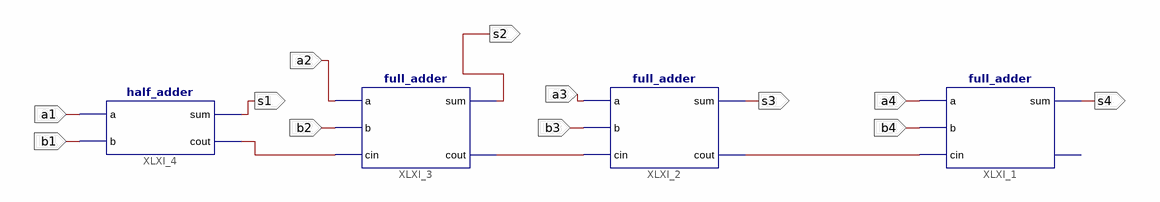
[diagram p0: schematic sheet 1]
// Xilinx ISE schematic ripple_carry_adder.sch (spartan3e) as structural Verilog: 4 symbols, 12 ports
module ripple_carry_adder (
  input  a1,
  input  b1,
  input  a2,
  input  b2,
  input  a3,
  input  b3,
  input  a4,
  input  b4,
  output s4,
  output s3,
  output s2,
  output s1
);

  wire XLXN_22, XLXN_23, XLXN_24;

  full_adder XLXI_1 (.a(a4), .b(b4), .cin(XLXN_24), .sum(s4));  // open: cout
  full_adder XLXI_2 (.a(a3), .b(b3), .cin(XLXN_23), .sum(s3), .cout(XLXN_24));
  full_adder XLXI_3 (.a(a2), .b(b2), .cin(XLXN_22), .sum(s2), .cout(XLXN_23));
  half_adder XLXI_4 (.a(a1), .b(b1), .sum(s1), .cout(XLXN_22));
endmodule
